# Altium schematic sheet MCU.SchDoc
size A4; Revision: B.2(PCB.SCH)
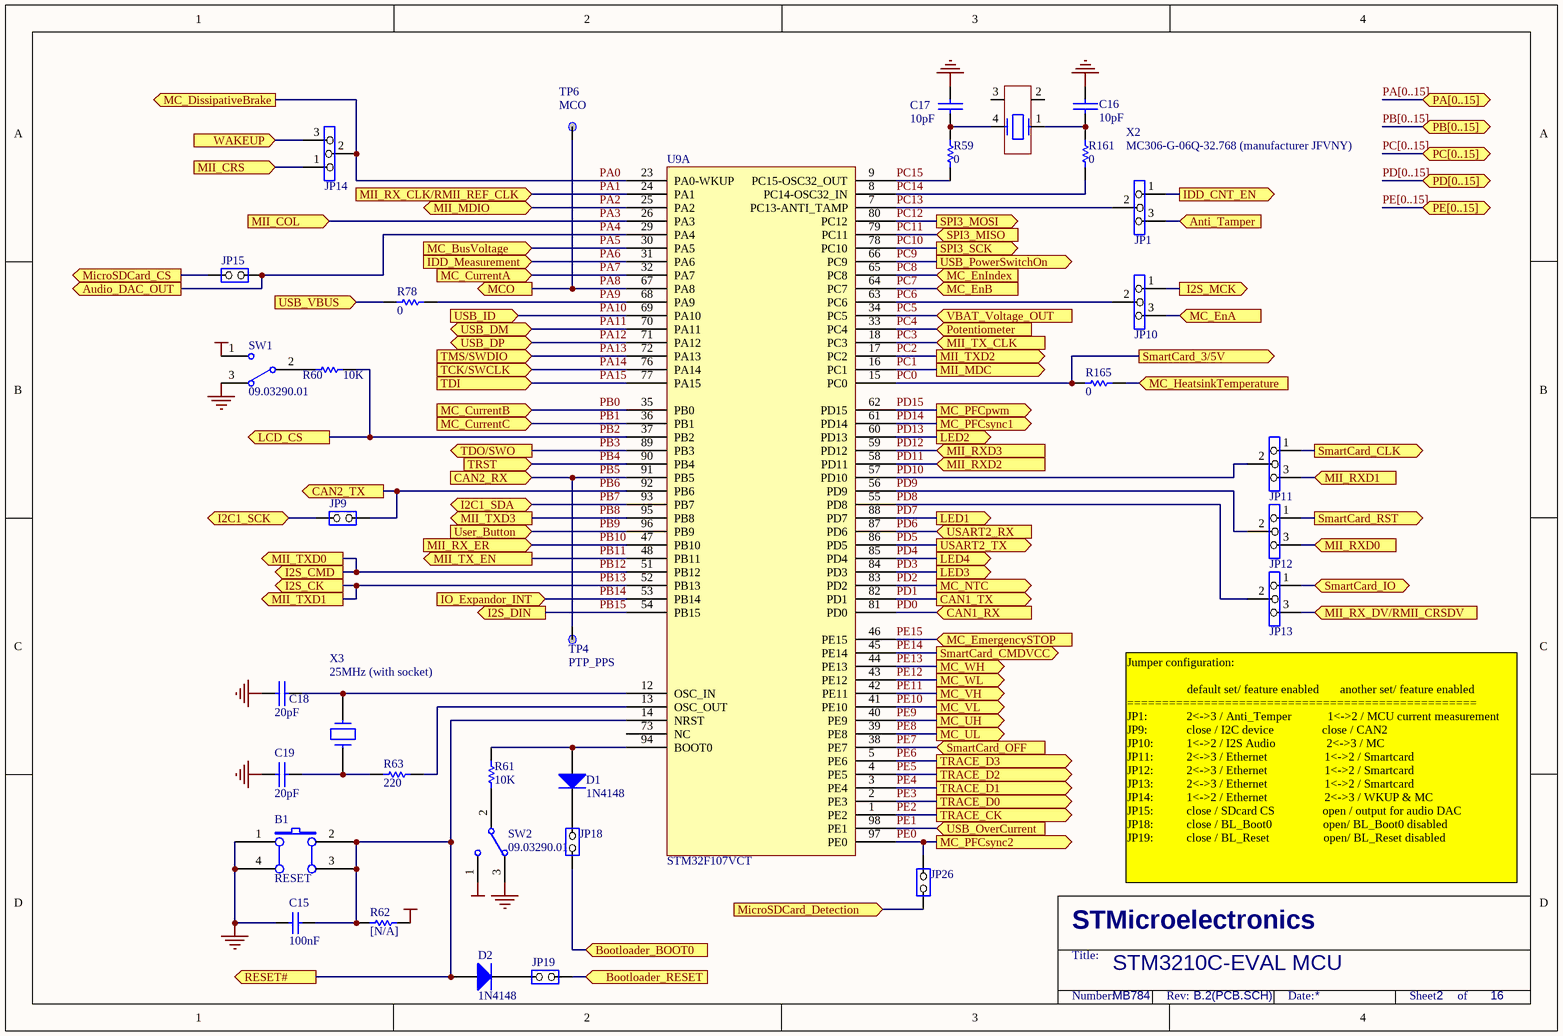
[diagram p0: MCU.SchDoc]

## Parts
B1  RESET  [PB10]
C15  100nF  [0603C]
C16  10pF  [0603C]
C17  10pF  [0603C]
C18  20pF  [0603C]
C19  20pF  [0603C]
D1  1N4148  [1504D]
D2  1N4148  [1504D]
JP1  (no value)  [SIP3]
JP9  (no value)  [SIP2]
JP10  (no value)  [SIP3]
JP11  (no value)  [SIP3]
JP12  (no value)  [SIP3]
JP13  (no value)  [SIP3]
JP14  (no value)  [SIP3]
JP15  (no value)  [SIP2]
JP18  (no value)  [SIP2]
JP19  (no value)  [SIP2]
JP26  (no value)  [SIP2]
R59  0  [0603R]
R60  10K  [0603R]
R61  10K  [0603R]
R62  [N/A]  [0603R]
R63  220  [0603R]
R78  0  [0603R]
R161  0  [0603R]
R165  0  [0603R]
SW1  09.03290.01  [SIP3]
SW2  09.03290.01  [SIP3]
TP4  PTP_PPS  [TP]
TP6  MCO  [TP]
U9  STM32F107VCT  [TQ100_TOOL]  (part A of 2)
X2  MC306-G-06Q-32.768 (manufacturer JFVNY)  [SM8]
X3  25MHz (with socket)  [XTAL_socket]

## Ports
Anti_Tamper (in), Audio_DAC_OUT (out), Bootloader_BOOT0 (in), Bootloader_RESET (in), CAN1_RX (in), CAN1_TX (out), CAN2_RX (in), CAN2_TX (out), I2C1_SCK (bidir), I2C1_SDA (bidir), I2S_CK (out), I2S_CMD (out), I2S_DIN (out), I2S_MCK (out), IDD_CNT_EN (out), IDD_Measurement (in), IO_Expandor_INT (in), LCD_CS (out), LED1 (out), LED2 (out), LED3 (out), LED4 (out), MC_BusVoltage (in), MC_CurrentA (in), MC_CurrentB (in), MC_CurrentC (in), MC_DissipativeBrake (out), MC_EmergencySTOP (in), MC_EnA (in), MC_EnB (in), MC_EnIndex (in), MC_HeatsinkTemperature (in), MC_NTC (out), MC_PFCpwm (out), MC_PFCsync1 (out), MC_PFCsync2 (out), MC_UH (out), MC_UL (out), MC_VH (out), MC_VL (out), MC_WH (out), MC_WL (out), MCO (out), MicroSDCard_CS (out), MicroSDCard_Detection (in), MII_COL (in), MII_CRS (in), MII_MDC (out), MII_MDIO (bidir), MII_RX_CLK/RMII_REF_CLK (in), MII_RX_DV/RMII_CRSDV (in), MII_RX_ER (in), MII_RXD0 (in), MII_RXD1 (in), MII_RXD2 (in), MII_RXD3 (in), MII_TX_CLK (in), MII_TX_EN (out), MII_TXD0 (out), MII_TXD1 (out), MII_TXD2 (out), MII_TXD3 (out), PA[0..15] (bidir), PB[0..15] (bidir), PC[0..15] (bidir), PD[0..15] (bidir), PE[0..15] (bidir), Potentiometer (in), RESET# (out), SmartCard_3/5V (out), SmartCard_CLK (out), SmartCard_CMDVCC (out), SmartCard_IO (bidir), SmartCard_OFF (in), SmartCard_RST (out), SPI3_MISO (in), SPI3_MOSI (out), SPI3_SCK (out), TCK/SWCLK (in), TDI (in), TDO/SWO (out), TMS/SWDIO (in), TRACE_CK (out), TRACE_D0 (out), TRACE_D1 (out), TRACE_D2 (out), TRACE_D3 (out), TRST (in), USART2_RX (in), USART2_TX (out), USB_DM (bidir), USB_DP (bidir), USB_ID (in), USB_OverCurrent (in), USB_PowerSwitchOn (out), USB_VBUS (in), User_Button (in), VBAT_Voltage_OUT (in), WAKEUP (in)

## Nets
+3V3: R62.2 SW1.1 SW2.1
GND: B1.1(A0) B1.4(A1) C15.1 C16.2 C17.2 C18.2 C19.2 SW1.3 SW2.3
Anti_Tamper: JP1.3 ; port Anti_Tamper
Bootloader_BOOT0: JP18.2(NO) ; port Bootloader_BOOT0
Bootloader_RESET: JP19.2(NO) ; port Bootloader_RESET
I2C1_SCK: JP9.2(NO) ; port I2C1_SCK
I2S_MCK: JP10.1 ; port I2S_MCK
IDD_CNT_EN: JP1.1 ; port IDD_CNT_EN
MC_EnA: JP10.3 ; port MC_EnA
MC_HeatsinkTemperature: R165.2 ; port MC_HeatsinkTemperature
MicroSDCard_CS: JP15.2(NO) ; port MicroSDCard_CS
MicroSDCard_Detection: JP26.1(COMMON) ; port MicroSDCard_Detection
MII_CRS: JP14.1 ; port MII_CRS
MII_RX_DV/RMII_CRSDV: JP13.3 ; port MII_RX_DV/RMII_CRSDV
MII_RXD0: JP12.3 ; port MII_RXD0
MII_RXD1: JP11.3 ; port MII_RXD1
PA0: JP14.2 U9.23(PA0-WKUP) ; port MC_DissipativeBrake
PA1: U9.24(PA1) ; port MII_RX_CLK/RMII_REF_CLK
PA2: U9.25(PA2) ; port MII_MDIO
PA3: U9.26(PA3) ; port MII_COL
PA4: JP15.1(COMMON) U9.29(PA4) ; port Audio_DAC_OUT
PA5: U9.30(PA5) ; port MC_BusVoltage
PA6: U9.31(PA6) ; port IDD_Measurement
PA7: U9.32(PA7) ; port MC_CurrentA
PA8: TP6.1 U9.67(PA8) ; port MCO
PA9: R78.2 U9.68(PA9)
PA10: U9.69(PA10) ; port USB_ID
PA11: U9.70(PA11) ; port USB_DM
PA12: U9.71(PA12) ; port USB_DP
PA13: U9.72(PA13) ; port TMS/SWDIO
PA14: U9.76(PA14) ; port TCK/SWCLK
PA15: U9.77(PA15) ; port TDI
PB0: U9.35(PB0) ; port MC_CurrentB
PB1: U9.36(PB1) ; port MC_CurrentC
PB2: R60.1 U9.37(PB2) ; port LCD_CS
PB3: U9.89(PB3) ; port TDO/SWO
PB4: U9.90(PB4) ; port TRST
PB5: TP4.1 U9.91(PB5) ; port CAN2_RX
PB6: JP9.1(COMMON) U9.92(PB6) ; port CAN2_TX
PB7: U9.93(PB7) ; port I2C1_SDA
PB8: U9.95(PB8) ; port MII_TXD3
PB9: U9.96(PB9) ; port User_Button
PB10: U9.47(PB10) ; port MII_RX_ER
PB11: U9.48(PB11) ; port MII_TX_EN
PB12: U9.51(PB12) ; port I2S_CMD, port MII_TXD0
PB13: U9.52(PB13) ; port I2S_CK, port MII_TXD1
PB14: U9.53(PB14) ; port IO_Expandor_INT
PB15: U9.54(PB15) ; port I2S_DIN
PC0: R165.1 U9.15(PC0) ; port SmartCard_3/5V
PC1: U9.16(PC1) ; port MII_MDC
PC2: U9.17(PC2) ; port MII_TXD2
PC3: U9.18(PC3) ; port MII_TX_CLK
PC4: U9.33(PC4) ; port Potentiometer
PC5: U9.34(PC5) ; port VBAT_Voltage_OUT
PC6: JP10.2 U9.63(PC6)
PC7: U9.64(PC7) ; port MC_EnB
PC8: U9.65(PC8) ; port MC_EnIndex
PC9: U9.66(PC9) ; port USB_PowerSwitchOn
PC10: U9.78(PC10) ; port SPI3_SCK
PC11: U9.79(PC11) ; port SPI3_MISO
PC12: U9.80(PC12) ; port SPI3_MOSI
PC13: JP1.2 U9.7(PC13-ANTI_TAMP)
PC14: R161.2 U9.8(PC14-OSC32_IN)
PC15: R59.2 U9.9(PC15-OSC32_OUT)
PD0: U9.81(PD0) ; port CAN1_RX
PD1: U9.82(PD1) ; port CAN1_TX
PD2: U9.83(PD2) ; port MC_NTC
PD3: U9.84(PD3) ; port LED3
PD4: U9.85(PD4) ; port LED4
PD5: U9.86(PD5) ; port USART2_TX
PD6: U9.87(PD6) ; port USART2_RX
PD7: U9.88(PD7) ; port LED1
PD8: JP13.2 U9.55(PD8)
PD9: JP12.2 U9.56(PD9)
PD10: JP11.2 U9.57(PD10)
PD11: U9.58(PD11) ; port MII_RXD2
PD12: U9.59(PD12) ; port MII_RXD3
PD13: U9.60(PD13) ; port LED2
PD14: U9.61(PD14) ; port MC_PFCsync1
PD15: U9.62(PD15) ; port MC_PFCpwm
PE0: JP26.2(NO) U9.97(PE0) ; port MC_PFCsync2
PE1: U9.98(PE1) ; port USB_OverCurrent
PE2: U9.1(PE2) ; port TRACE_CK
PE3: U9.2(PE3) ; port TRACE_D0
PE4: U9.3(PE4) ; port TRACE_D1
PE5: U9.4(PE5) ; port TRACE_D2
PE6: U9.5(PE6) ; port TRACE_D3
PE7: U9.38(PE7) ; port SmartCard_OFF
PE8: U9.39(PE8) ; port MC_UL
PE9: U9.40(PE9) ; port MC_UH
PE10: U9.41(PE10) ; port MC_VL
PE11: U9.42(PE11) ; port MC_VH
PE12: U9.43(PE12) ; port MC_WL
PE13: U9.44(PE13) ; port MC_WH
PE14: U9.45(PE14) ; port SmartCard_CMDVCC
PE15: U9.46(PE15) ; port MC_EmergencySTOP
RESET#: B1.2(B0) B1.3(B1) C15.2 D2.1(A) R62.1 U9.14(NRST) ; port RESET#
SmartCard_CLK: JP11.1 ; port SmartCard_CLK
SmartCard_IO: JP13.1 ; port SmartCard_IO
SmartCard_RST: JP12.1 ; port SmartCard_RST
USB_VBUS: R78.1 ; port USB_VBUS
WAKEUP: JP14.3 ; port WAKEUP
NetC16_1: C16.1 R161.1 X2.1
NetC17_1: C17.1 R59.1 X2.4
NetC18_1: C18.1 U9.12(OSC_IN) X3.2
NetC19_1: C19.1 R63.2 X3.1
NetD1_1: D1.1(A) R61.1 U9.94(BOOT0)
NetD1_2: D1.2(K) JP18.1(COMMON)
NetD2_2: D2.2(K) JP19.1(COMMON)
NetR60_2: R60.2 SW1.2
NetR61_2: R61.2 SW2.2
NetR63_1: R63.1 U9.13(OSC_OUT)

Not connected (* = marked no-connect by the designer): U9 73(NC); X2 2 3

## Buses and harness runs
bus PA[0..15] = port PA[0..15]
bus PB[0..15] = port PB[0..15]
bus PC[0..15] = port PC[0..15]
bus PD[0..15] = port PD[0..15]
bus PE[0..15] = port PE[0..15]

## Notes on the sheet
- (near JP13) Jumper configuration:
  default set/ feature enabled       another set/ feature enabled
  ==================================================
  JP1:             2<->3 / Anti_Temper            1<->2 / MCU current measurement
  JP9:             close / I2C device                close / CAN2
  JP10:           1<->2 / I2S Audio                 2<->3 / MC
  JP11:           2<->3 / Ethernet                   1<->2 / Smartcard
  JP12:           2<->3 / Ethernet                   1<->2 / Smartcard
  JP13:           2<->3 / Ethernet                   1<->2 / Smartcard
  JP14:           1<->2 / Ethernet                   2<->3 / WKUP & MC
  JP15:           close / SDcard CS                open / output for audio DAC
  JP18:           close / BL_Boot0                 open/ BL_Boot0 disabled
  JP19:           close / BL_Reset                  open/ BL_Reset disabled
- STM3210C-EVAL MCU
- MB784
- 2
- 16
- STMicroelectronics
- Title:
- Number:
- Rev:
- Date:
- Sheet       of

## Library data of the parts
B1 = SW PUSHBUTTON: SE PUSHBUTTON
C15 = CAP: Capacitor; Value: 100pF; Published: 8-Jun-2000; Revision: July-2002: Re-released for DXP Platform.; Publisher: Altium Limited
C16-C19 = CAP: Capacitor
D1 D2 = Diode: Default Diode; Code - JEDEC: DO-214-AB; Published: 8-Jun-2000; Revision: July-2002: Re-released for DXP Platform.; Publisher: Altium Limited
JP1 JP10-JP14 = Jumper3
JP9 JP15 JP18 JP19 JP26 = JP2
R59 R63 R78 R161 R165 = Res1: Resistor; Value: 1K; Published: 8-Jun-2000; Revision: July-2002: Re-released for DXP Platform.; Publisher: Altium Limited
R60-R62 = res1: Resistor; Value: 1K; Published: 8-Jun-2000; Revision: July-2002: Re-released for DXP Platform.; Publisher: Altium Limited
SW1 SW2 = SW-SPDT: SPDT Subminiature Toggle Switch, Right Angle Mounting, Vertical Actuation; Revision 1: Jul-2002: Re-released for DXP Platform.; Revision 2: 17-Dec-2003: Schematic revised, PCB Footprint replaced.; Published: 24-Mar-1999; Datasheet: Latest Revision: 05-Dec-2000; Publisher: Altium Limited
TP4 TP6 = TP
U9 = BARRACUDA_256K
X2 = MC306
X3 = CRYSTAL